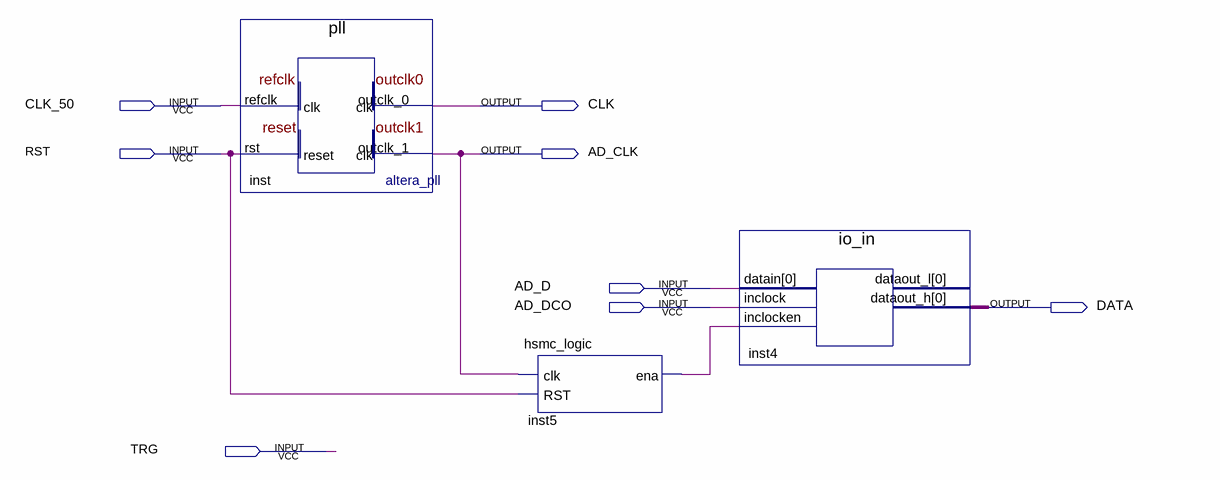
[diagram p0: schematic sheet]
// Quartus schematic hsmc_1.bdf as structural Verilog: 3 symbols, 8 pins
module hsmc_1 (
  input  CLK_50,
  input  RST,
  input  AD_D,
  input  AD_DCO,
  input  TRG,
  output CLK,
  output AD_CLK,
  output DATA
);

  wire inst5_ena;

  pll inst (.refclk(CLK_50), .rst(RST), .outclk_0(CLK), .outclk_1(AD_CLK));
  hsmc_logic inst5 (.clk(AD_CLK), .RST(RST), .ena(inst5_ena));
  io_in inst4 (.datain(AD_D), .inclock(AD_DCO), .inclocken(inst5_ena), .dataout_h(DATA));  // open: dataout_l
endmodule
